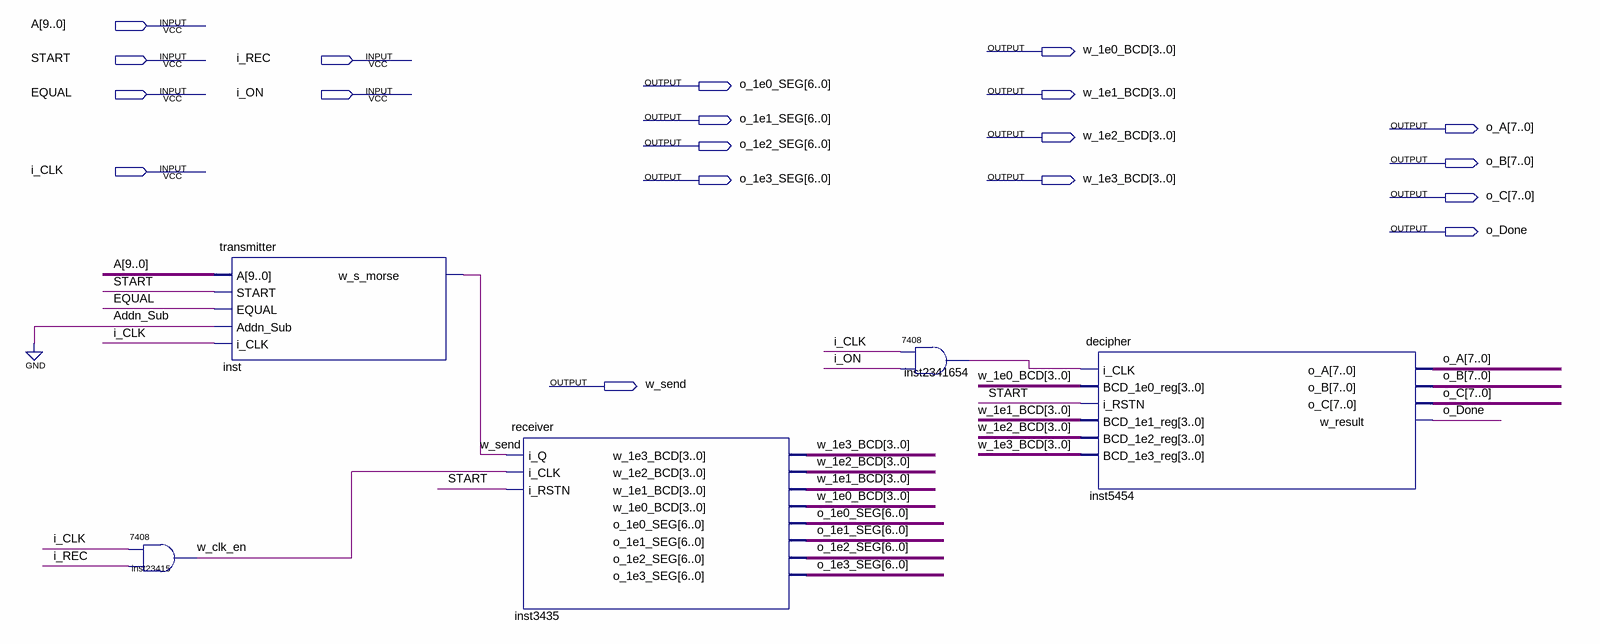
[diagram p0: schematic sheet]
// Quartus schematic top.bdf as structural Verilog: 5 symbols, 19 pins
module top (
  input  [9:0] A,
  input  START,
  input  i_REC,
  input  EQUAL,
  input  i_ON,
  input  i_CLK,
  output [3:0] w_1e0_BCD,
  output [6:0] o_1e0_SEG,
  output [3:0] w_1e1_BCD,
  output [6:0] o_1e1_SEG,
  output [7:0] o_A,
  output [3:0] w_1e2_BCD,
  output [6:0] o_1e2_SEG,
  output [7:0] o_B,
  output [6:0] o_1e3_SEG,
  output [3:0] w_1e3_BCD,
  output [7:0] o_C,
  output o_Done,
  output w_send
);

  wire inst2341654_1, w_clk_en;

  \7408  inst23415 (.\3 (i_REC), .\2 (i_CLK), .\1 (w_clk_en));
  transmitter inst (.A(A), .START(START), .EQUAL(EQUAL), .Addn_Sub(1'b0), .i_CLK(i_CLK), .w_s_morse(w_send));
  receiver inst3435 (
    .i_Q(w_send), .i_CLK(w_clk_en), .i_RSTN(START), .w_1e3_BCD(w_1e3_BCD), .w_1e2_BCD(w_1e2_BCD),
    .w_1e1_BCD(w_1e1_BCD), .w_1e0_BCD(w_1e0_BCD), .o_1e0_SEG(o_1e0_SEG), .o_1e1_SEG(o_1e1_SEG),
    .o_1e2_SEG(o_1e2_SEG), .o_1e3_SEG(o_1e3_SEG));
  \7408  inst2341654 (.\3 (i_ON), .\2 (i_CLK), .\1 (inst2341654_1));
  decipher inst5454 (
    .i_CLK(inst2341654_1), .BCD_1e0_reg(w_1e0_BCD), .i_RSTN(START), .BCD_1e1_reg(w_1e1_BCD),
    .BCD_1e2_reg(w_1e2_BCD), .BCD_1e3_reg(w_1e3_BCD), .o_A(o_A), .o_B(o_B), .o_C(o_C), .w_result(o_Done));
endmodule
